# EAGLE design Eleven (EAGLE 6.2)
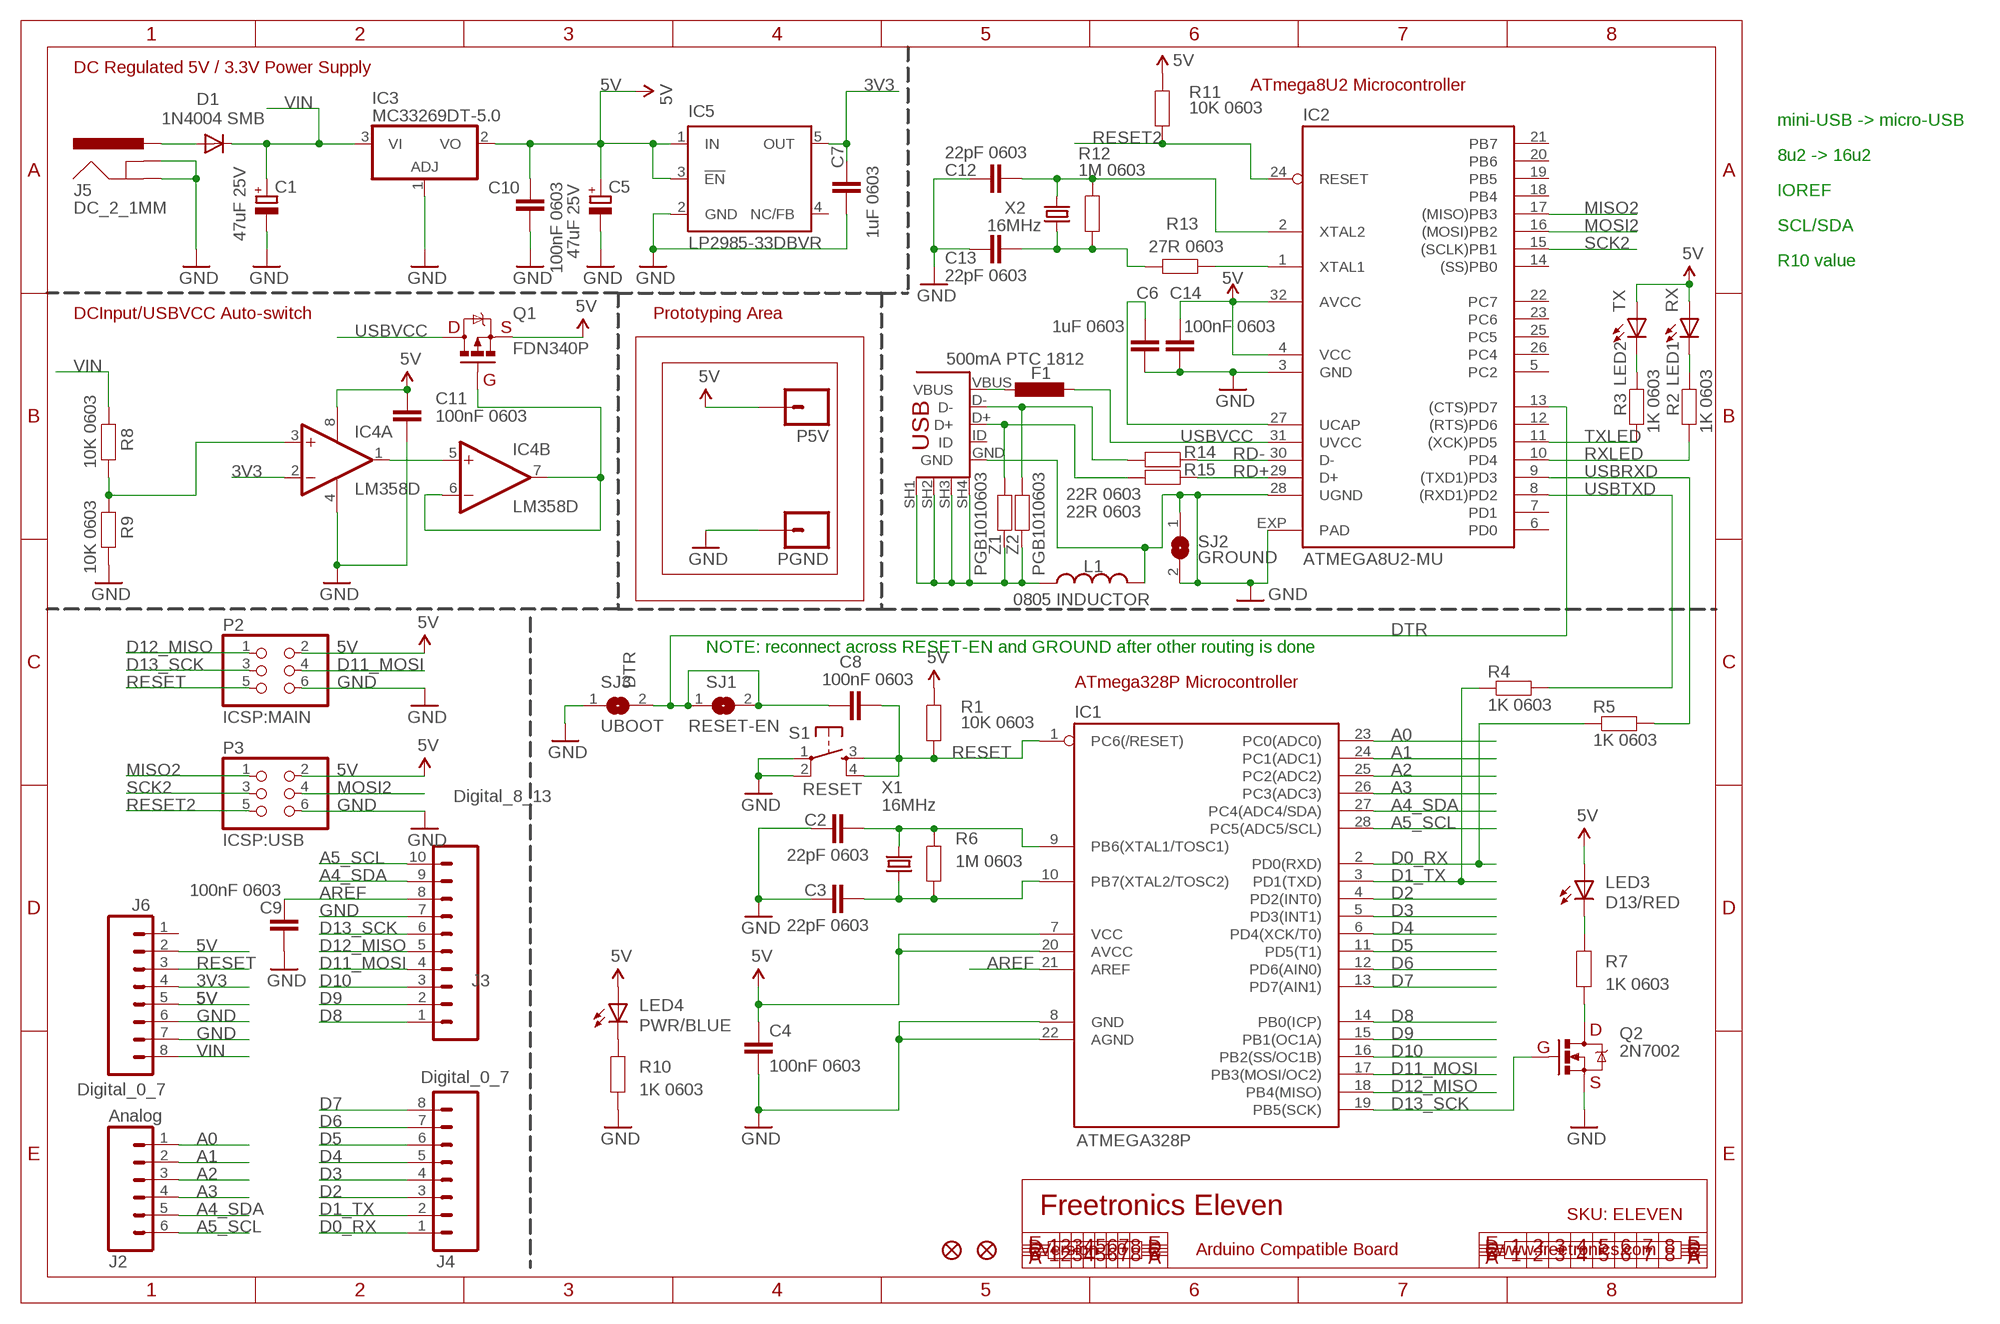
[diagram p0: schematic, sheet 1]

## Parts
C1  47uF 25V  CPOL-EUD  [PANASONIC_D]
C2  22pF 0603  CAP0603  [0603]
C3  22pF 0603  CAP0603  [0603]
C4  100nF 0603  CAP0603  [0603]
C5  47uF 25V  CPOL-EUD  [PANASONIC_D]
C6  1uF 0603  CAP0603  [0603]
C7  1uF 0603  CAP0603  [0603]
C8  100nF 0603  CAP0603  [0603]
C9  100nF 0603  CAP0603  [0603]
C10  100nF 0603  CAP0603  [0603]
C11  100nF 0603  CAP0603  [0603]
C12  22pF 0603  CAP0603  [0603]
C13  22pF 0603  CAP0603  [0603]
C14  100nF 0603  CAP0603  [0603]
D1  1N4004 SMB  DIODESMB  [SMB-DIODE]
F1  500mA PTC 1812  L-EUL1812  [L1812]
IC1  ATMEGA328P  AVR-MEGA8-P  [DIL28-3]
IC2  ATMEGA8U2-MU  ATMEL_ATMEGA8U2-MUQFN  [ATMEL_QFN32]
IC3  MC33269DT-5.0  MC33269D-5.0  [DPACK]
IC4  LM358D  [SO08]
IC5  LP2985-33DBVR  TEXAS_TPS77033  [TEXAS_SOT23-DBV]
J2  Analog  M06SIP  [1X06]
J3  Digital_8_13  M100.1  [1X10]
J4  Digital_0_7  M08  [1X08]
J5  DC_2_1MM  POWER_JACKPTH  [POWER_JACK_PTH]
J6  Digital_0_7  M08  [1X08]
L1  0805 INDUCTOR  INDUCTOR0805-LARGE  [0805-LARGE]
LED1  RX  LED0603  [LED-0603]
LED2  TX  LED0603  [LED-0603]
LED3  D13/RED  LED0603  [LED-0603]
LED4  PWR/BLUE  LED0603  [LED-0603]
P1  USB-FT  [USB-MINIB-FT]
P2  ICSP:MAIN  PINHD-2X3  [2X03]
P3  ICSP:USB  PINHD-2X3  [2X03]
P5V  M01SMD  [LUXEON-PAD]
PGND  M01SMD  [LUXEON-PAD]
Q1  FDN340P  MOSFET-PCHANNEL  [SOT23]
Q2  2N7002  MOSFET-NCHANNELSMD  [SOT23-3]
R1  10K 0603  RESISTOR0603  [0603]
R2  1K 0603  RESISTOR0603  [0603]
R3  1K 0603  RESISTOR0603  [0603]
R4  1K 0603  RESISTOR0603  [0603]
R5  1K 0603  RESISTOR0603  [0603]
R6  1M 0603  RESISTOR0603  [0603]
R7  1K 0603  RESISTOR0603  [0603]
R8  10K 0603  RESISTOR0603  [0603]
R9  10K 0603  RESISTOR0603  [0603]
R10  1K 0603  RESISTOR0603  [0603]
R11  10K 0603  RESISTOR0603  [0603]
R12  1M 0603  RESISTOR0603  [0603]
R13  27R 0603  RESISTOR0603  [0603]
R14  22R 0603  RESISTOR0603  [0603]
R15  22R 0603  RESISTOR0603  [0603]
S1  RESET  TAC_SWITCHSMD  [TACTILE_SWITCH_SMD]
SJ1  RESET-EN  SJ  [SJ]
SJ2  GROUND  SJ  [SJ]
SJ3  UBOOT  SJ  [SJ]
U$5  FIDUCIAL1X2.5  [FIDUCIAL-1X2.5]
U$14  FIDUCIAL1X2.5  [FIDUCIAL-1X2.5]
X1  16MHz  CRYSTALHC49UV  [HC49U-V]
X2  16MHz  CRYSTALHC49UV  [HC49U-V]
Z1  PGB1010603  RESISTOR0603  [0603]
Z2  PGB1010603  RESISTOR0603  [0603]

## Nets
3V3: C7.2 IC4.2(A:-IN) IC5.5(OUT) J6.4
5V: C4.1 C5.+ C10.1 C11.1 C14.1 IC1.7(VCC) IC1.20(AVCC) IC2.4(VCC) IC2.32(AVCC) IC3.2(VO) IC4.8(P:V+) IC5.1(IN) IC5.3(!EN) J6.2 J6.5 LED1.A LED2.A LED3.A LED4.A P2.2 P3.2 P5V.P$1 Q1.2(S) R1.2 R11.2
A0: IC1.23(PC0(ADC0)) J2.1
A1: IC1.24(PC1(ADC1)) J2.2
A2: IC1.25(PC2(ADC2)) J2.3
A3: IC1.26(PC3(ADC3)) J2.4
A4_SDA: IC1.27(PC4(ADC4/SDA)) J2.5 J3.9
A5_SCL: IC1.28(PC5(ADC5/SCL)) J2.6 J3.10
AREF: C9.1 IC1.21(AREF) J3.8
D0_RX: IC1.2(PD0(RXD)) J4.1 R5.1
D1_TX: IC1.3(PD1(TXD)) J4.2 R4.1
D2: IC1.4(PD2(INT0)) J4.3
D3: IC1.5(PD3(INT1)) J4.4
D4: IC1.6(PD4(XCK/T0)) J4.5
D5: IC1.11(PD5(T1)) J4.6
D6: IC1.12(PD6(AIN0)) J4.7
D7: IC1.13(PD7(AIN1)) J4.8
D8: IC1.14(PB0(ICP)) J3.1
D9: IC1.15(PB1(OC1A)) J3.2
D10: IC1.16(PB2(SS/OC1B)) J3.3
D11_MOSI: IC1.17(PB3(MOSI/OC2)) J3.4 P2.4
D12_MISO: IC1.18(PB4(MISO)) J3.5 P2.1
D13_SCK: IC1.19(PB5(SCK)) J3.6 P2.3 Q2.1(G)
DTR: C8.1 IC2.13((CTS)PD7) SJ1.1 SJ1.2 SJ3.2
GND: C1.- C2.1 C3.1 C4.2 C5.- C6.2 C7.1 C9.2 C10.2 C11.2 C12.1 C13.1 C14.2 IC1.8(GND) IC1.22(AGND) IC2.3(GND) IC2.28(UGND) IC2.EXP(PAD) IC3.1(ADJ) IC4.4(P:V-) IC5.2(GND) J3.7 J5.GND J5.GNDBREAK J6.6 J6.7 L1.2 P1.GND P2.6 P3.6 PGND.P$1 Q2.2(S) R9.1 R10.1 S1.1 S1.2 SJ2.1 SJ2.2 SJ3.1
MISO2: IC2.17((MISO)PB3) P3.1
MOSI2: IC2.16((MOSI)PB2) P3.4
N$2: IC2.1(XTAL1) R13.1
N$3: L1.1 P1.SH1(SH$1) P1.SH2(SH$2) P1.SH3(SH$3) P1.SH4(SH$4) Z1.2 Z2.2
N$4: LED3.C R7.2
N$5: C2.2 IC1.9(PB6(XTAL1/TOSC1)) R6.2 X1.2
N$6: Q2.3(D) R7.1
N$7: C3.2 IC1.10(PB7(XTAL2/TOSC2)) R6.1 X1.1
N$8: D1.A J5.PWR
N$9: IC4.3(A:+IN) R8.1 R9.2
N$10: IC4.1(A:OUT) IC4.5(B:+IN)
N$11: LED1.C R2.2
N$12: IC4.6(B:-IN) IC4.7(B:OUT) Q1.1(G)
N$13: LED2.C R3.2
N$14: LED4.C R10.2
N$16: P1.D+ R15.2 Z1.1
N$17: P1.D- R14.2 Z2.1
N$113: C12.2 IC2.2(XTAL2) R12.2 X2.2
N$114: C13.2 R12.1 R13.2 X2.1
N$115: F1.1 P1.VBUS
N$117: C6.1 IC2.27(UCAP)
RD+: IC2.29(D+) R15.1
RD-: IC2.30(D-) R14.1
RESET: C8.2 IC1.1(PC6(/RESET)) J6.3 P2.5 R1.1 S1.3 S1.4
RESET2: IC2.24(RESET) P3.5 R11.1
RXLED: IC2.10(PD4) R2.1
SCK2: IC2.15((SCLK)PB1) P3.3
TXLED: IC2.11((XCK)PD5) R3.1
USBRXD: IC2.9((TXD1)PD3) R5.2
USBTXD: IC2.8((RXD1)PD2) R4.2
USBVCC: F1.2 IC2.31(UVCC) Q1.3(D)
VIN: C1.+ D1.C IC3.3(VI) J6.8 R8.2
Unconnected: IC2.5(PC2) IC2.6(PD0) IC2.7(PD1) IC2.12((RTS)PD6) IC2.14((SS)PB0) IC2.18(PB4) IC2.19(PB5) IC2.20(PB6) IC2.21(PB7) IC2.22(PC7) IC2.23(PC6) IC2.25(PC5) IC2.26(PC4) IC5.4(NC/FB) J6.1 P1.ID

## Notes on the sheet
- DC Regulated 5V / 3.3V Power Supply
- ATmega8U2 Microcontroller
- mini-USB -> micro-USB
- 8u2 -> 16u2
- IOREF
- SCL/SDA
- R10 value
- DCInput/USBVCC Auto-switch | Prototyping Area
- D | S
- G
- NOTE: reconnect across RESET-EN and GROUND after other routing is done
- ATmega328P Microcontroller
- D
- G
- S
- Freetronics Eleven
- SKU: ELEVEN
- Version 1.0 | Arduino Compatible Board | www.freetronics.com

## Library data of the parts
C1 C5 = rcl:CPOL-EU: POLARIZED CAPACITOR, European symbol
C2-C4 C6-C14 = freetronics:CAP: Capacitor Standard 0603 ceramic capacitor, and 0.1" leaded capacitor.
D1 = freetronics:DIODE: Diode These are standard reverse protection diodes and small signal diodes. SMA package can handle up to about 1A. SOD-323 can handle about 200mA. What the SOD-323 package when ordering, there are some mfgs out there that are 5-pin packages.
F1 = rcl:L-EU: INDUCTOR, European symbol
IC1 = freetronics:AVR-MEGA8-P: MICROCONTROLLER 8 Kbytes FLASH 1 kbytes SRAM 512 bytes EEPROM USART 4-channel 10 bit ADC 2-channel 8 bit ADC
IC2 = freetronics-jon:ATMEL_ATMEGA8U2-MU
IC3 = linear:MC33269?*: Adjustable Output Low Dropout Voltage Regulator 800 mA Source: http://www.onsemi.com/pub/Collateral/MC33269-D.PDF
IC4 = linear:LM358: OP AMP also LM158; LM258; LM2904 Source: http://cache.national.com/ds/LM/LM158.pdf
IC5 = freetronics-jon:TEXAS_TPS770*: ULTRALOW-POWER 50-mA LOW-DROPOUT LINEAR REGULATORS 50-mA Low-Dropout Regulator Source: http://focus.ti.com/lit/ds/symlink/tps77001.pdf
J2 = freetronics:M06: Header 6 Standard 6-pin 0.1" header. Use with straight break away headers (SKU : PRT-00116), right angle break away headers (PRT-00553), swiss pins (PRT-00743), machine pins (PRT-00117), and female headers (PRT-00115). Molex polarized connector foot print use with SKU : PRT-08094 with associated crimp pins and housings. NOTES ON THE VARIANTS LOCK and LOCK_LONGPADS... This footprint was designed to help hold the alignment of a through-hole component (i.e. 6-pin header) while soldering it into place. You may notice that each hole has been shifted either up or down by 0.005 of an inch from it's more standard position (which is a perfectly straight line). This slight alteration caused the pins (the squares in the middle) to touch the edges of the holes. Because they are alternating, it causes a "brace" to hold the component in place. 0.005 has proven to be the perfect amount of "off-center" position when using our standard breakaway headers. Although looks a little odd when you look at the bare footprint, once you have a header in there, the alteration is very hard to notice. Also, if you push a header all the way into place, it is covered up entirely on the bottom side. This idea of altering the position of holes to aid alignment will be further integrated into the Sparkfun Library for other footprints. It can help hold any component with 3 or more connection pins.
J3 = freetronics-original:M10: Header 10 Standard 10-pin 0.1" header. Use with straight break away headers (SKU : PRT-00116), right angle break away headers (PRT-00553), swiss pins (PRT-00743), machine pins (PRT-00117), and female headers (PRT-00115).
J4 J6 = freetronics:M08: Header 8 Standard 8-pin 0.1" header. Use with straight break away headers (SKU : PRT-00116), right angle break away headers (PRT-00553), swiss pins (PRT-00743), machine pins (PRT-00117), and female headers (PRT-00115).
J5 = freetronics:POWER_JACK: Power Jack This is the standard 5.5mm barrel jack for power. The PTH is the most common, proven, reliable, footprint. All others are experimental. The Slot footprint only works if the mill layer is transmitted to the PCB fab house so be warned. Spark Fun Electronics SKU : PRT-00119. Mating wall wart : TOL-00298 (and others)
L1 = freetronics-master-v1:INDUCTOR: Inductors Basic Inductor/Choke - 0603 and 1206. Footprints are not proven and vary greatly between part numbers.
LED1-LED4 = freetronics:LED: LEDs Standard schematic elements and footprints for 5mm, 3mm, 1206, and 0603 sized LEDs. 5mm - Spark Fun Electronics SKU : COM-00529 (and others)
P1 = freetronics-master-v1:USB-FT
P2 P3 = pinhead:PINHD-2X3: PIN HEADER
P5V PGND = freetronics:M01: Header 1 Standard 1-pin 0.1" header. Use with straight break away headers (SKU : PRT-00116), right angle break away headers (PRT-00553), swiss pins (PRT-00743), machine pins (PRT-00117), and female headers (PRT-00115).
Q1 = freetronics-master-v1:MOSFET-PCHANNEL
Q2 = freetronics:MOSFET-NCHANNEL
R1-R15 Z1 Z2 = freetronics:RESISTOR: Resistor Basic schematic elements and footprints for 0603, 1206, and PTH 1/10th watt (small) resistors.
S1 = freetronics:TAC_SWITCH: Momentary Switch Button commonly used for reset or general input. Spark Fun Electronics SKU : COM-00097
SJ1-SJ3 = jumper:SJ: SMD solder JUMPER
U$5 U$14 = freetronics:FIDUCIAL: Fiducial Alignment Points Various fiducial points for machine vision alignment.
X1 X2 = freetronics-master-v1:CRYSTAL: Crystals Various standard crystals. Proven footprints. Spark Fun Electronics SKU : COM-00534

## Board
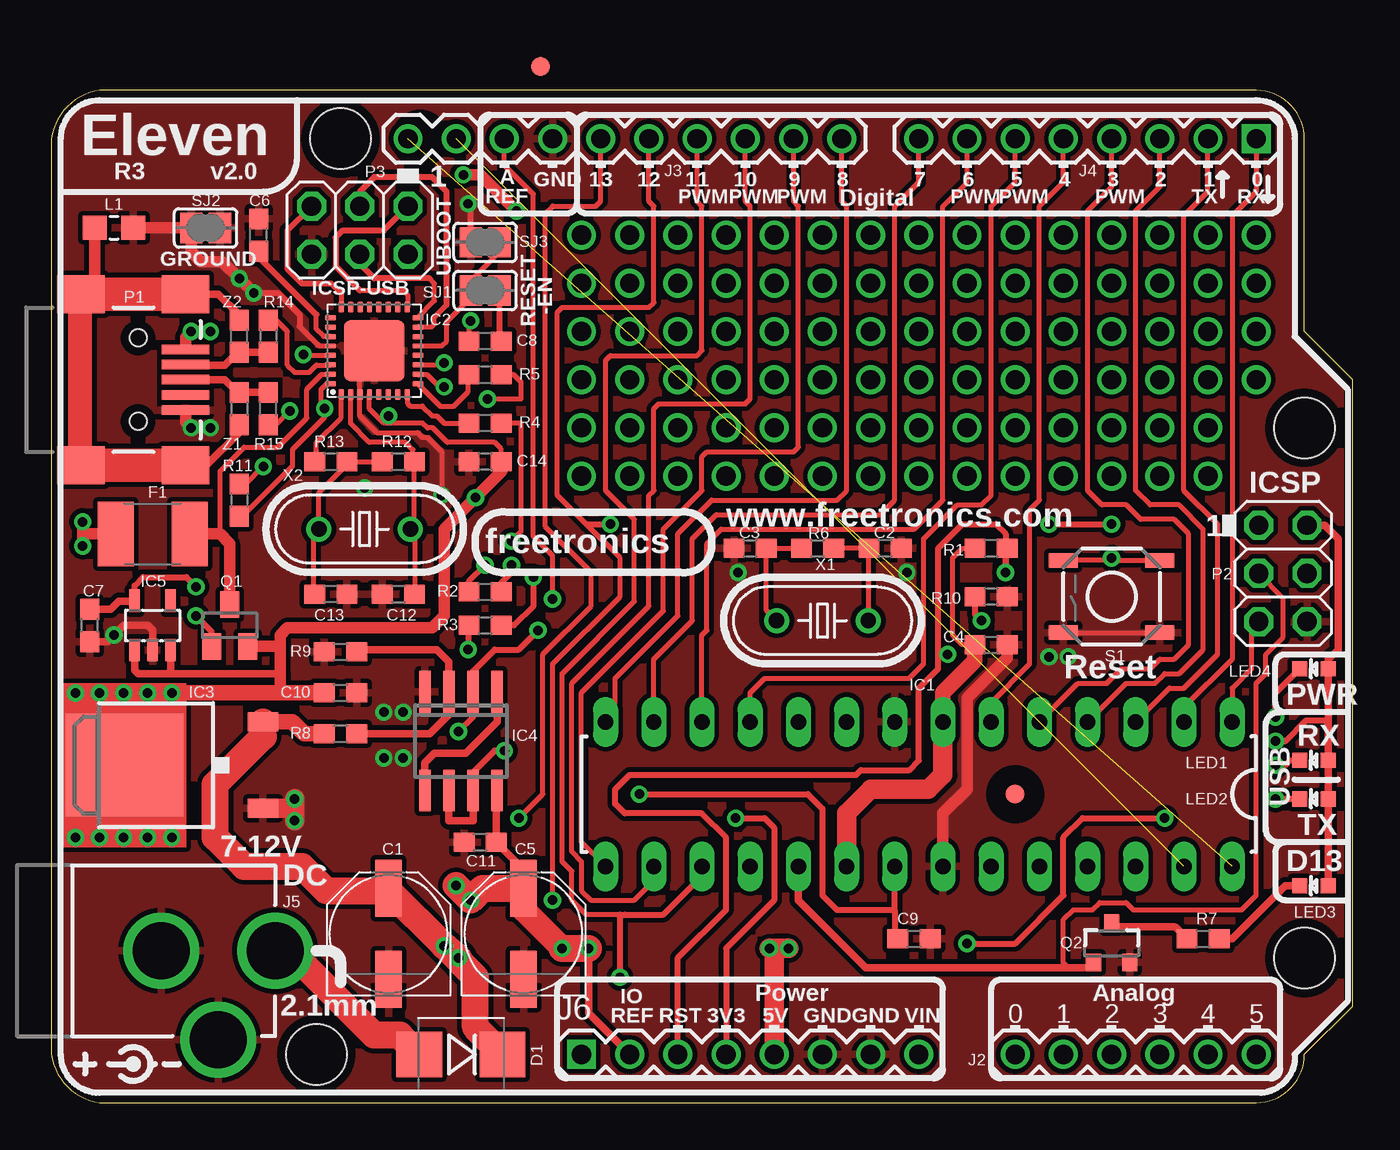
[diagram p1: board, top side]
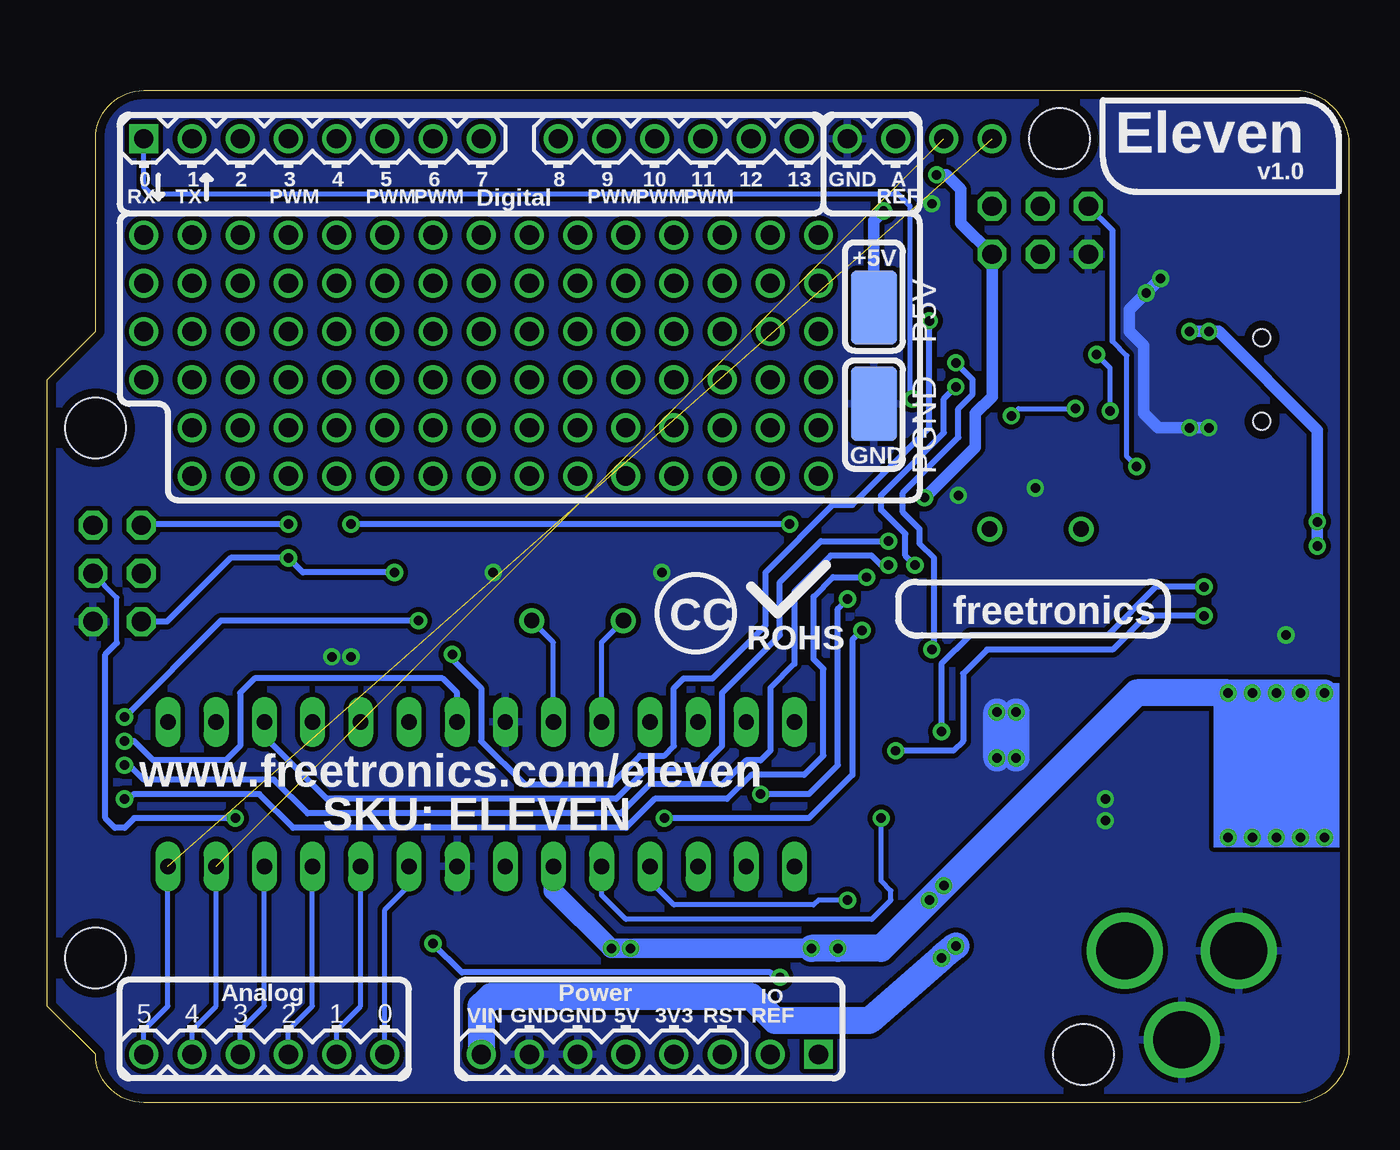
[diagram p2: board, bottom side, seen from below]

Size 68.58 x 53.34 mm. Coordinates in mm from the lower left corner, seen from the top.
Outline: 0,2.54 arc74 2.54,0 63.5,0 arc90 66.04,2.54 68.58,5.08 68.58,38.1 66.04,40.64 66.04,50.8 arc90 63.5,53.34 2.54,53.34 arc74 0,50.8 0,2.54
Copper layers (1*16): Top 0.035mm / dielectric 1.5mm / Bottom 0.035mm
Design rules: minimum track width 10mil, minimum drill 18mil, track to track 10mil, track to pad 10mil, pad to pad 10mil, via to via 10mil, smd to smd 8mil, copper to edge 18mil, drill to drill 8mil, minimum pad ring 10mil, minimum via ring 8mil, stop-mask expansion 4mil, vias tented up to drill 25mil, thermal gap 10mil
Holes 3.2 mm at 66.04,35.56 66.04,7.62 15.24,50.8 13.97,2.54
tRestrict: area 18.4,49.8 to 20.4,51.8; area 49.8,15.2 to 51.8,17.3

### Footprints (pad centres in the part's own frame; a part is rotated, then mirrored left to right if it is on the bottom)
PANASONIC_D = smd 3 x 1.4: + 2.4,0; - -2.4,0
0603 = smd 1.1 x 1: 1 -0.85,0; 2 0.85,0
SMB-DIODE = smd 2.4 x 2.4: A 2.2,0; C -2.2,0
L1812 = smd 1.9 x 3.4: 1 -1.95,0; 2 1.95,0
DIL28-3 = drill 0.813 long: 1 -16.51,-3.81; 2 -13.97,-3.81; 3 -11.43,-3.81; 4 -8.89,-3.81; 5 -6.35,-3.81; 6 -3.81,-3.81; 7 -1.27,-3.81; 8 1.27,-3.81; 9 3.81,-3.81; 10 6.35,-3.81; 11 8.89,-3.81; 12 11.43,-3.81; 13 13.97,-3.81; 14 16.51,-3.81; 15 16.51,3.81; 16 13.97,3.81; 17 11.43,3.81; 18 8.89,3.81; 19 6.35,3.81; 20 3.81,3.81; 21 1.27,3.81; 22 -1.27,3.81; 23 -3.81,3.81; 24 -6.35,3.81; 25 -8.89,3.81; 26 -11.43,3.81; 27 -13.97,3.81; 28 -16.51,3.81
ATMEL_QFN32 = smd 0.6 x 0.3: 1 -2.3,1.75; 2 -2.3,1.25; 3 -2.3,0.75; 4 -2.3,0.25; 5 -2.3,-0.25; 6 -2.3,-0.75; 7 -2.3,-1.25; 8 -2.3,-1.75; 17 2.3,-1.75; 18 2.3,-1.25; 19 2.3,-0.75; 20 2.3,-0.25; 21 2.3,0.25; 22 2.3,0.75; 23 2.3,1.25; 24 2.3,1.75 | smd 0.3 x 0.6: 9 -1.75,-2.3; 10 -1.25,-2.3; 11 -0.75,-2.3; 12 -0.25,-2.3; 13 0.25,-2.3; 14 0.75,-2.3; 15 1.25,-2.3; 16 1.75,-2.3; 25 1.75,2.3; 26 1.25,2.3; 27 0.75,2.3; 28 0.25,2.3; 29 -0.25,2.3; 30 -0.75,2.3; 31 -1.25,2.3; 32 -1.75,2.3 | smd 3.2 x 3.2: EXP 0,0
DPACK = smd 1 x 1.6: 1 -2.28,-4.8; 3 2.28,-4.8 | smd 5.4 x 6.2: 2 0,2.5
SO08 = smd 0.6 x 2.2: 1 -1.905,-2.6; 2 -0.635,-2.6; 3 0.635,-2.6; 4 1.905,-2.6; 5 1.905,2.6; 6 0.635,2.6; 7 -0.635,2.6; 8 -1.905,2.6
TEXAS_SOT23-DBV = smd 0.55 x 1.2: 1 -0.95,-1.3; 2 0,-1.3; 3 0.95,-1.3; 4 0.95,1.3; 5 -0.95,1.3
1X06 = drill 1.016: 1 0,0; 2 2.54,0; 3 5.08,0; 4 7.62,0; 5 10.16,0; 6 12.7,0
1X10 = drill 1.016: 1 0,0; 2 2.54,0; 3 5.08,0; 4 7.62,0; 5 10.16,0; 6 12.7,0; 7 15.24,0; 8 17.78,0; 9 20.32,0; 10 22.86,0
1X08 = drill 1.016 square: 1 0,0 | drill 1.016: 2 2.54,0; 3 5.08,0; 4 7.62,0; 5 10.16,0; 6 12.7,0; 7 15.24,0; 8 17.78,0
POWER_JACK_PTH = drill 2.997: GND 0,7.7; GNDBREAK 4.7,10.7; PWR 0,13.7
0805-LARGE = smd 1.27 x 1.27: 1 -1.016,0; 2 1.016,0
LED-0603 = smd 0.8 x 0.8: A 0,-0.75; C 0,0.75
USB-MINIB-FT = smd 2.5 x 0.5: D+ 2.5,0; D- 2.5,0.8; GND 2.5,-1.6; ID 2.5,-0.8; VBUS 2.5,1.6 | smd 2.5 x 2: SH1 -3,-4.5; SH2 -3,4.5; SH3 2.5,4.5; SH4 2.5,-4.5 | hole 0.9: 0,2.2; 0,-2.2
2X03 = drill 1.016 octagon: 1 -2.54,-1.27; 2 -2.54,1.27; 3 0,-1.27; 4 0,1.27; 5 2.54,-1.27; 6 2.54,1.27
LUXEON-PAD = smd 3.9 x 2.4: P$1 0,0
SOT23 = smd 1 x 1.4: 1 -0.95,-1.1; 2 0.95,-1.1; 3 0,1.1
SOT23-3 = smd 0.8 x 0.9: 1 -0.95,-1; 2 0.95,-1; 3 0,1.1
TACTILE_SWITCH_SMD = smd 1.524 x 0.762: 1 -2.54,1.905; 2 2.54,1.905; 3 -2.54,-1.905; 4 2.54,-1.905
SJ = smd 1.168 x 1.6: 1 -0.762,0; 2 0.762,0
FIDUCIAL-1X2.5 = smd 1 x 1: 1 0,0
HC49U-V = drill 0.813: 1 -2.413,0; 2 2.413,0

### Placement (x,y rotation side)
C1  17.78,8.89 90 top
C2  43.94,29.21 180 top
C3  36.83,29.21 0 top
C4  49.53,24.13 0 top
C5  24.89,8.89 90 top
C6  10.92,45.72 90 top
C7  2.03,25.15 90 top
C8  22.86,40.13 180 top
C9  45.47,8.64 0 top
C10  15.24,21.59 0 top
C11  22.61,13.72 180 top
C12  18.29,26.8 0 top
C13  14.73,26.8 180 top
C14  22.86,33.78 180 top
D1  21.59,2.54 180 top
F1  5.33,29.97 0 top
IC1  45.72,16.26 180 top
IC2  17.02,39.62 90 top
IC3  6.35,17.78 90 top
IC4  21.59,19.05 180 top
IC5  5.33,25.15 0 top
J2  50.8,2.54 0 top
J3  41.66,50.8 180 top
J4  63.5,50.8 180 top
J5  -1.91,8 270 top
J6  27.94,2.54 0 top
L1  3.3,46.1 0 top
LED1  66.55,18.03 90 top
LED2  66.55,16 90 top
LED3  66.55,11.43 90 top
LED4  66.55,22.86 90 top
P1  4.57,38.1 0 top
P2  64.91,27.89 270 top
P3  16.26,45.97 180 top
P5V  25.02,41.91 270 bottom
PGND  25.02,36.83 270 bottom
Q1  9.4,25.15 0 top
Q2  55.88,8.38 0 top
R1  49.53,29.21 180 top
R2  22.86,26.92 0 top
R3  22.86,25.15 0 top
R4  22.86,35.81 180 top
R5  22.86,38.35 180 top
R6  40.39,29.21 0 top
R7  60.71,8.64 0 top
R8  15.24,19.43 180 top
R9  15.24,23.75 0 top
R10  49.53,26.67 180 top
R11  9.91,31.75 270 top
R12  18.29,33.78 0 top
R13  14.73,33.78 0 top
R14  11.43,40.39 270 top
R15  11.43,36.58 90 top
S1  55.88,26.67 180 top
SJ1  22.86,42.8 0 top
SJ2  8.13,46.1 0 top
SJ3  22.86,45.34 0 top
U$5  25.78,54.61 0 top
U$14  50.8,16.26 0 top
X1  40.64,25.4 0 top
X2  16.51,30.23 0 top
Z1  9.91,36.58 270 top
Z2  9.91,40.39 90 top

### Tracks (layer width: path | path; a pad name or v marks a point on that pad's centre or on a via)
3V3  (via drill 0.5)
  Top 0.305: J6.4 35.56,8.13 38.1,10.67 38.1,14.48 37.59,14.99 v36.07,14.99 | v25.65,24.89 24.64,23.88 23.37,23.88 22.23,22.73 IC4.2 22.23,20.32 v21.46,19.56 | IC5.5 4.38,27.24 4.83,27.69 7.11,27.69 v7.62,27.18
  Top 0.406: C7.2 3.14,26 3.56,26.42 4.35,26.42 IC5.5
  Bottom 0.305: v36.07,14.99 28.45,14.99 26.16,17.27 26.16,24.38 v25.65,24.89 | v7.62,27.18 10.16,27.18 12.7,24.64 19.94,24.64 21.46,23.11 v21.46,19.56
5V  (via drill 0.5)
  Top 0.254: R1.2 48.01,29.21 47.5,28.7 47.5,24.64 48.01,24.13 C4.1 | 17.78,35.81 19.56,35.81 19.81,35.56 20.11,35.56 20.87,34.8 23.37,34.8 23.71,34.46 C14.1 23.75,33.78 | 17.78,35.81 17.53,35.81 16.77,36.57 IC2.4 | IC2.32 14.51,37.87 14.22,37.59 14.22,36.75 v14.4,36.58 14.4,36.12 12.7,34.42 12.7,33.53 10.07,30.9 R11.2 | 17.78,35.81 v17.78,36.2 | 12.06,24.13 11.98,24.05
  Top 0.305: 67.3,20.15 66.12,20.15 65.02,19.05 v64.52,19.05
  Top 0.406: IC4.8 23.46,16.41 C11.1 24.64,12.53 | 24.89,10.16 24.64,12.53 | LED3.A LED2.A LED1.A 67.3,20.15 LED4.A 67.3,23.36 67.82,23.88 67.82,29.72 67.11,30.43 P2.2 | IC5.1 4.38,22.79 4.57,22.61 6.22,22.61 | 12.06,22.61 6.22,22.61 | IC5.3 6.28,22.67 6.22,22.61 | 24.64,12.53 24.89,12.28 C5.+ | J6.2 28.32,4.7 v28.32,8.13
  Top 0.61: 23.75,33.78 23.75,33.27 v22.35,31.88 20.7,30.23 20.7,25.65 20.07,25.02 12.45,25.02 12.06,24.64 12.06,24.13 12.06,22.61 12.06,21.59 | 11.98,24.05 Q1.2 | v24.51,46.99 22.61,48.9 v21.72,48.9
  Top 0.813: v5.08,21.59 v6.35,21.59 12.06,21.59 C10.1 | IC1.7 46.99,21.59 48.68,23.28 C4.1
  Top 1.016: IC3.2 3.85,18.07 5.08,19.3 v5.08,21.59 | 38.1,8.13 J6.5 | v37.85,8.13 38.1,8.13 | v38.86,8.13 38.1,8.13 | IC1.20 41.91,15.24 43.18,16.51 46.23,16.51 46.99,17.27 IC1.7
  Top 1.27: v26.92,8.13 24.89,10.16
  Top 1.422: v26.92,8.13 28.31,8.13 | v21.34,11.43 v22.1,10.67 22.72,11.29 C5.+
  Bottom 0.254: v14.4,36.58 17.4,36.58 v17.78,36.2
  Bottom 0.305: v64.52,19.05 64.01,19.05 62.99,18.03 59.18,18.03 58.42,18.8 58.42,21.59 57.66,22.35 47.75,22.35 46.99,21.59 IC1.7
  Bottom 0.61: v21.72,48.9 21.21,48.9 20.45,48.13 20.45,46.35 P3.2 18.8,37.21 19.68,36.32 19.68,34.54 v22.35,31.88 | P5V.P$1 25.02,46.48 v24.51,46.99
  Bottom 1.016: IC1.20 41.91,11.18 v38.86,8.13 v37.85,8.13 v28.32,8.13
  Bottom 1.422: v28.32,8.13 v26.92,8.13 24.64,8.13 11.18,21.59 v6.35,21.59 1.27,21.59
A0
  Bottom 0.254: J2.1 50.8,10.16 49.53,11.43 IC1.23
A1
  Bottom 0.254: J2.2 53.34,3.81 52.07,5.08 IC1.24
A2
  Bottom 0.254: J2.3 55.88,3.81 54.61,5.08 IC1.25
A3
  Bottom 0.254: J2.4 58.42,3.81 57.15,5.08 IC1.26
A4_SDA  (1 unrouted)
  Bottom 0.254: J2.5 60.96,3.81 59.69,5.08 IC1.27
A5_SCL  (1 unrouted)
  Bottom 0.254: J2.6 63.5,3.81 62.23,5.08 IC1.28
AREF  (via drill 0.5)
  Top 0.254: J3.8 23.88,49.4 25.4,47.88 25.4,29.84 26.42,28.83 v26.42,26.54
  Top 0.305: 44.45,10.16 44.45,8.64 | 44.45,10.16 IC1.21 | 44.45,10.16 41.4,10.16 40.64,10.92 40.64,15.49 39.88,16.26 v30.99,16.26
  Top 0.406: 44.45,8.64 C9.1
  Bottom 0.305: v30.99,16.26 28.45,16.26 26.92,17.78 26.92,26.04 v26.42,26.54
D0_RX  (via drill 0.5)
  Top 0.254: IC1.2 59.69,20.83 62.23,23.37 62.23,46.74 63.5,48.01 J4.1 | R5.1 24.38,38.35 24.77,37.97 24.77,37.08 v22.99,37.08
  Bottom 0.254: v22.99,37.08 23.11,37.34 23.11,47.24 23.75,47.88 63.12,47.88 63.5,48.26 J4.1
D1_TX  (via drill 0.5)
  Top 0.254: IC1.3 58.93,21.84 59.69,21.84 61.47,23.62 61.47,30.48 59.69,32.26 59.69,46.74 60.96,48.01 J4.2 | v24.26,29.59 24.77,30.1 24.77,35.81 R4.1
  Bottom 0.305: v24.26,29.59 27.81,29.59 29.97,27.43 29.97,24.64 33.02,21.59 33.02,18.8 34.29,17.53 37.08,17.53 38.61,16 53.85,16 57.15,19.3 IC1.3
D2
  Top 0.254: IC1.4 56.64,22.1 58.17,22.1 58.67,22.61 59.44,22.61 60.71,23.88 60.71,30.23 59.44,31.5 57.91,31.5 57.15,32.26 57.15,46.99 58.42,48.26 J4.3
D3
  Top 0.254: IC1.5 54.1,22.1 55.63,22.1 56.39,22.86 57.91,22.86 58.42,23.37 59.18,23.37 59.94,24.13 59.94,29.97 59.18,30.73 57.4,30.73 56.64,31.5 55.37,31.5 54.61,32.26 54.61,46.99 55.88,48.26 J4.4
D4
  Top 0.254: IC1.6 49.53,21.08 51.56,23.11 51.56,31.24 52.07,31.75 52.07,47.24 53.34,48.51 J4.5
D5
  Top 0.254: J4.6 50.8,48.51 49.53,47.24 49.53,32 49.02,31.5 47.75,31.5 45.97,29.72 45.97,23.11 45.21,22.35 37.59,22.35 36.83,21.59 IC1.11
D6
  Top 0.254: J4.7 48.26,48.51 46.99,47.24 46.99,31.75 45.47,30.23 35.31,30.23 34.54,29.46 34.54,24.89 34.29,24.64 IC1.12
D7
  Top 0.254: J4.8 45.72,48.51 44.45,47.24 44.45,31.75 43.69,30.99 35.05,30.99 33.78,29.72 33.78,25.4 31.75,23.37 IC1.13
D8
  Top 0.254: J3.1 41.66,47.5 41.91,47.24 41.91,32.26 41.4,31.75 34.8,31.75 33.02,29.97 33.02,25.65 29.72,22.35 29.72,21.08 29.21,20.57 IC1.14
D9
  Top 0.254: J3.2 39.12,47.5 39.37,47.24 39.37,34.54 39.12,34.29 34.54,34.29 34.29,34.04 34.29,32.26 32.26,30.23 32.26,25.91 27.94,21.59 27.94,13.72 IC1.15
D10
  Top 0.254: J3.3 36.58,47.5 36.83,47.24 36.83,37.08 36.58,36.83 32,36.83 31.75,36.58 31.75,32.26 31.5,32 31.5,26.16 27.43,22.1 27.43,13.21 27.94,12.7 27.94,11.18 28.45,10.67 30.73,10.67 31.75,11.68 IC1.16
D11_MOSI  (via drill 0.5)
  Top 0.254: J3.4 34.04,47.5 34.29,47.24 34.29,39.62 34.04,39.37 29.46,39.37 29.21,39.12 29.21,32.26 30.73,30.73 30.73,26.42 26.92,22.61 26.92,12.7 27.43,12.19 27.43,10.67 28.19,9.91 29.97,9.91
  Top 0.305: IC1.17 34.29,11.94 32.26,9.91 30.23,9.91 29.97,9.91 v29.97,6.6 | v58.67,14.99 54.36,14.99 53.34,13.97 53.34,10.92 50.8,8.38 v48.26,8.38
  Bottom 0.254: P2.4 64.92,26.61 64.92,24.23
  Bottom 0.305: 64.92,24.23 65.53,23.62 65.53,14.99 65.02,14.48 64.52,14.48 64.01,14.99 v58.67,14.99 | v48.26,8.38 46.74,6.86 30.48,6.86 30.23,6.6 v29.97,6.6
D12_MISO  (via drill 0.5)
  Top 0.254: J3.5 31.5,47.5 31.75,47.24 31.75,42.16 31.5,41.91 26.92,41.91 26.67,41.66 26.67,32 28.19,30.48 29.97,28.7 29.97,26.67 26.42,23.11 v26.42,10.67
  Top 0.305: v52.58,30.48 v55.88,30.48 | 28.19,30.48 v29.46,30.48
  Bottom 0.254: v26.42,10.67 27.94,10.67 28.19,10.41 35.56,10.41 36.83,11.68 IC1.18
  Bottom 0.305: P2.1 63.59,30.48 v55.88,30.48 | v29.46,30.48 v52.58,30.48
D13_SCK  (via drill 0.5)
  Top 0.254: J3.6 28.96,47.5 28.7,47.24 26.42,47.24 26.04,46.86 26.04,30.35 28.45,27.94 28.45,26.16 25.91,23.62 25.91,16.26 v24.64,14.99 | P2.3 64.92,26.57 64.92,24.54 64.01,23.62 64.01,22.61 63.5,22.1 63.5,10.92 62.74,10.16 57.02,10.16 56.64,10.54 55.24,10.54 54.86,10.16 53.85,10.16 53.34,9.65 53.34,7.37 53.59,7.11
  Top 0.406: IC1.19 39.37,10.67 42.93,7.11 53.59,7.11 54.66,7.11 Q2.1
  Bottom 0.254: v24.64,14.99 24.64,11.68 24.13,11.18 24.13,10.67 25.15,9.65 38.1,9.65 39.37,10.92 IC1.19
DTR
  Top 0.254: IC2.13 20.57,39.88 20.83,40.13 20.83,41.15 22.1,42.42 SJ1.1 22.1,43.31 23.37,44.58 23.37,45.09 SJ3.2
  Top 0.305: C8.1 23.62,40.73 SJ1.2
  Top 0.61: SJ1.1 SJ1.2
GND  (via drill 0.5)
  Top 0.254: S1.2 S1.1 | 16.26,37.34 IC2.3 | 16.26,37.34 16.26,39.62 IC2.EXP | 16.26,37.34 16.26,36.2 17.14,35.31 19.3,35.31 19.56,35.05 19.81,35.05 20.57,34.29 v20.57,32 | IC2.28 14.1,39.87 13.08,40.89
  Top 0.305: SJ3.1 22.1,47.24 v21.97,47.37 | 13.08,40.89 13.08,41.53 11.94,42.67 v10.67,42.67
  Top 0.406: IC5.2 5.33,24.89 5.08,25.15 3.81,25.15 v3.3,24.64 2.96,24.3 C7.1
  Top 0.61: C4.2 50.38,23.46 48.26,21.34 48.26,16.51 46.99,15.24 IC1.22 | v8.38,35.56 v7.37,35.56 7.07,35.85 7.07,36.41 | v10.67,42.67 v9.91,43.43 9.02,44.32 7.87,44.32 7.37,44.83 SJ2.1 | SJ2.1 L1.2 | SJ2.1 SJ2.2
  Top 1.016: 12.83,15.5 v12.83,16 | 12.83,15.5 v12.83,14.86 | IC3.1 12.83,15.5
  Bottom 0.61: v7.37,35.56 10.03,35.56 10.79,36.32 10.79,39.88 11.56,40.64 11.56,41.78 v10.67,42.67 v9.91,43.43
  Bottom 1.422: v18.54,18.16 v18.54,20.57 | v17.53,18.16 v17.53,20.57
  other vias: 36.2,27.94 16.51,32.38 52.58,23.5 53.59,23.5 45.09,27.94
  pour Bottom: 0,50.8 arc-74 2.54,53.34 63.5,53.34 arc-74 66.04,50.8 66.04,40.64 68.58,38.1 68.58,5.08 66.04,2.54 arc-74 63.5,0 2.54,0 arc-74 0,2.54
  pour Top: 0,50.8 arc-74 2.54,53.34 63.5,53.34 arc-74 66.04,50.8 66.04,40.64 68.58,38.1 68.58,5.08 66.04,2.54 arc-74 63.5,0 2.54,0 arc-74 0,2.54
MISO2
  Top 0.254: IC2.17 18.8,41.95 18.8,42.55 18.54,42.8 16.26,42.8
  Top 0.305: 16.26,42.8 14.99,44.07 14.99,45.59 15.37,45.97 17.53,45.97 P3.1
MOSI2
  Top 0.254: IC2.16 20.19,42.25 20.19,43.18 19.94,43.43
  Top 0.305: 19.94,43.43 17.02,43.43 16.26,44.2 P3.4
N$2
  Top 0.254: R13.1 13.97,34.38 13.97,34.8 15.27,36.1 IC2.1
N$3
  Top 0.406: P1.SH3 8.8,42.6 9.91,41.53 Z2.2 | P1.SH4 8.16,33.6 9.91,35.31 Z1.2 | 1.52,42.55 P1.SH2 | 1.52,33.66 P1.SH1
  Top 0.61: 2.29,42.6 L1.1
  Top 1.27: 1.52,33.66 1.52,42.55
  Top 1.778: P1.SH2 2.29,42.6 P1.SH3 | P1.SH1 P1.SH4
N$4
  Top 0.406: R7.2 62.23,8.64 65.02,11.43 LED3.C
N$5
  Top 0.254: R6.2 C2.2 43.09,25.44 X1.2
  Bottom 0.254: X1.2 41.91,24.26 IC1.9
N$6
  Top 0.406: R7.1 59.26,9.23 59.18,9.27 56.09,9.27 Q2.3
N$7
  Top 0.254: X1.1 37.68,25.95 C3.2 R6.1
  Bottom 0.254: X1.1 39.37,24.26 IC1.10
N$8
  Top 1.422: D1.A 18.37,3.56 17.02,3.56 12.57,8 J5.PWR
N$9
  Top 0.406: R8.1 19.94,19.43 20.95,20.45 IC4.3 20.95,23.24 20.32,23.88 16.26,23.88 16.22,23.91 16.22,23.96 R9.2
N$10
  Top 0.406: IC4.5 19.68,17.91 20.19,18.41 21.84,18.41 23.5,20.07 IC4.1
N$11  (via drill 0.5)
  Top 0.305: LED1.C 65.28,18.03 65.02,17.78 v64.52,17.78 | R2.2 23.71,27.39 24.26,27.94 v24.26,28.32
  Bottom 0.305: v64.52,17.78 64.26,17.78 63.5,17.02 56.64,17.02 54.86,15.24 38.35,15.24 36.83,16.76 33.02,16.76 31.75,18.03 30.99,18.03 30.48,18.54 30.48,21.84 29.21,23.11 29.21,26.92 27.3,28.83 25.15,28.83 24.64,28.32 v24.26,28.32
N$12  (via drill 0.5)
  Top 0.305: 22.16,16.45 22.23,16.38 22.23,17.4 23.37,18.54 v23.88,18.54 | Q1.1 8.45,24.83 v7.62,25.65
  Top 0.406: IC4.7 22.23,16.38 22.23,14.86 20.95,14.86 IC4.6
  Bottom 0.305: v7.62,25.65 10.67,25.65 12.45,23.88 19.05,23.88 20.32,22.61 20.32,19.05 20.83,18.54 v23.88,18.54
N$13  (via drill 0.5)
  Top 0.305: v64.52,16 LED2.C | v25.4,27.69 25.4,26.16 24.38,25.15 R3.2
  Bottom 0.305: v25.4,27.69 27.18,27.69 28.19,26.67 28.19,23.37 27.69,22.86 27.69,18.29 28.7,17.27 31.5,17.27 32.77,16 36.58,16 38.1,14.48 55.63,14.48 57.4,16.26 64.01,16.26 v64.52,16
N$14  (via drill 0.5)
  Top 0.305: LED4.C 64.52,21.58 v64.52,20.32 | v49.02,25.4 48.68,25.74 R10.2
  Bottom 0.305: v64.52,20.32 59.44,25.4 v49.02,25.4
N$15  (via drill 1.02)
  other vias: 33.02,40.64
N$16
  Top 0.406: P1.D+ 9.14,38.1 9.82,37.43 Z1.1 R15.2
N$17
  Top 0.406: P1.D- 7.11,38.86 9.14,38.86 9.82,39.54 Z2.1 R14.2
N$18  (via drill 1.02)
  other vias: 33.02,43.18
N$19  (via drill 1.02)
  other vias: 33.02,45.72
N$20  (via drill 1.02)
  other vias: 30.48,40.64
N$21  (via drill 1.02)
  other vias: 30.48,43.18
N$22  (via drill 1.02)
  other vias: 30.48,45.72
N$23  (via drill 1.02)
  other vias: 27.94,40.64
N$24  (via drill 1.02)
  other vias: 27.94,43.18
N$25  (via drill 1.02)
  other vias: 27.94,45.72
N$26  (via drill 1.02)
  other vias: 40.64,40.64
N$27  (via drill 1.02)
  other vias: 40.64,43.18
N$28  (via drill 1.02)
  other vias: 40.64,45.72
N$29  (via drill 1.02)
  other vias: 38.1,40.64
N$30  (via drill 1.02)
  other vias: 38.1,43.18
N$31  (via drill 1.02)
  other vias: 38.1,45.72
N$32  (via drill 1.02)
  other vias: 35.56,40.64
N$33  (via drill 1.02)
  other vias: 35.56,43.18
N$34  (via drill 1.02)
  other vias: 35.56,45.72
N$35  (via drill 1.02)
  other vias: 48.26,40.64
N$36  (via drill 1.02)
  other vias: 48.26,43.18
N$37  (via drill 1.02)
  other vias: 48.26,45.72
N$38  (via drill 1.02)
  other vias: 45.72,40.64
N$39  (via drill 1.02)
  other vias: 45.72,43.18
N$40  (via drill 1.02)
  other vias: 45.72,45.72
N$41  (via drill 1.02)
  other vias: 43.18,40.64
N$42  (via drill 1.02)
  other vias: 43.18,43.18
N$43  (via drill 1.02)
  other vias: 43.18,45.72
N$44  (via drill 1.02)
  other vias: 55.88,40.64
N$45  (via drill 1.02)
  other vias: 55.88,43.18
N$46  (via drill 1.02)
  other vias: 55.88,45.72
N$47  (via drill 1.02)
  other vias: 53.34,40.64
N$48  (via drill 1.02)
  other vias: 53.34,43.18
N$49  (via drill 1.02)
  other vias: 53.34,45.72
N$50  (via drill 1.02)
  other vias: 50.8,40.64
N$51  (via drill 1.02)
  other vias: 50.8,43.18
N$52  (via drill 1.02)
  other vias: 50.8,45.72
N$53  (via drill 1.02)
  other vias: 63.5,40.64
N$54  (via drill 1.02)
  other vias: 63.5,43.18
N$55  (via drill 1.02)
  other vias: 63.5,45.72
N$56  (via drill 1.02)
  other vias: 60.96,40.64
N$57  (via drill 1.02)
  other vias: 60.96,43.18
N$58  (via drill 1.02)
  other vias: 60.96,45.72
N$59  (via drill 1.02)
  other vias: 58.42,40.64
N$60  (via drill 1.02)
  other vias: 58.42,43.18
N$61  (via drill 1.02)
  other vias: 58.42,45.72
N$62  (via drill 1.02)
  other vias: 33.02,33.02
N$63  (via drill 1.02)
  other vias: 33.02,35.56
N$64  (via drill 1.02)
  other vias: 33.02,38.1
N$65  (via drill 1.02)
  other vias: 30.48,33.02
N$66  (via drill 1.02)
  other vias: 30.48,35.56
N$67  (via drill 1.02)
  other vias: 30.48,38.1
N$68  (via drill 1.02)
  other vias: 27.94,33.02
N$69  (via drill 1.02)
  other vias: 27.94,35.56
N$70  (via drill 1.02)
  other vias: 27.94,38.1
N$71  (via drill 1.02)
  other vias: 40.64,33.02
N$72  (via drill 1.02)
  other vias: 40.64,35.56
N$73  (via drill 1.02)
  other vias: 40.64,38.1
N$74  (via drill 1.02)
  other vias: 38.1,33.02
N$75  (via drill 1.02)
  other vias: 38.1,35.56
N$76  (via drill 1.02)
  other vias: 38.1,38.1
N$77  (via drill 1.02)
  other vias: 35.56,33.02
N$78  (via drill 1.02)
  other vias: 35.56,35.56
N$79  (via drill 1.02)
  other vias: 35.56,38.1
N$80  (via drill 1.02)
  other vias: 48.26,33.02
N$81  (via drill 1.02)
  other vias: 48.26,35.56
N$82  (via drill 1.02)
  other vias: 48.26,38.1
N$83  (via drill 1.02)
  other vias: 45.72,33.02
N$84  (via drill 1.02)
  other vias: 45.72,35.56
N$85  (via drill 1.02)
  other vias: 45.72,38.1
N$86  (via drill 1.02)
  other vias: 43.18,33.02
N$87  (via drill 1.02)
  other vias: 43.18,35.56
N$88  (via drill 1.02)
  other vias: 43.18,38.1
N$89  (via drill 1.02)
  other vias: 55.88,33.02
N$90  (via drill 1.02)
  other vias: 55.88,35.56
N$91  (via drill 1.02)
  other vias: 55.88,38.1
N$92  (via drill 1.02)
  other vias: 53.34,33.02
N$93  (via drill 1.02)
  other vias: 53.34,35.56
N$94  (via drill 1.02)
  other vias: 53.34,38.1
N$95  (via drill 1.02)
  other vias: 50.8,33.02
N$96  (via drill 1.02)
  other vias: 50.8,35.56
N$97  (via drill 1.02)
  other vias: 50.8,38.1
N$98  (via drill 0.5)
  other vias: 6.35,13.97
N$99  (via drill 0.5)
  other vias: 5.08,13.97
N$100  (via drill 1.02)
  other vias: 63.5,38.1
N$101  (via drill 1.02)
  other vias: 60.96,33.02
N$102  (via drill 1.02)
  other vias: 60.96,35.56
N$103  (via drill 1.02)
  other vias: 60.96,38.1
N$104  (via drill 1.02)
  other vias: 58.42,33.02
N$105  (via drill 1.02)
  other vias: 58.42,35.56
N$106  (via drill 1.02)
  other vias: 58.42,38.1
N$107  (via drill 0.5)
  other vias: 3.81,13.97
N$108  (via drill 0.5)
  other vias: 2.54,13.97
N$109  (via drill 0.5)
  other vias: 3.81,21.59
N$110  (via drill 0.5)
  other vias: 2.54,21.59
N$111  (via drill 0.5)
  other vias: 1.27,21.59
N$112  (via drill 0.5)
  other vias: 1.27,13.97
N$113
  Top 0.254: C12.2 19.18,26.71 19.18,29.97 X2.2 19.14,30.7 R12.2 19.05,33.87 19.05,34.42 18.67,34.8 16.76,34.8 15.77,35.79 IC2.2
N$114
  Top 0.254: C13.2 13.84,26.71 13.84,29.97 X2.1 14.1,32.13 15.58,33.62 R13.2 R12.1
N$115  (via drill 0.5)
  Top 0.406: 7.07,39.79 P1.VBUS
  Top 0.61: v7.37,40.64 7.2,40.47 | v7.37,40.64 v8.38,40.64 | 1.65,29.97 F1.1 | 1.65,29.97 v1.65,30.61 | v1.65,29.34 1.65,29.97 | v7.37,40.64 7.07,40.35 7.07,39.79
  Bottom 0.61: v1.65,29.34 1.65,35.43 6.86,40.64 v7.37,40.64 v8.38,40.64
N$117
  Top 0.254: 10.88,44.62 C6.1 | 13.97,41.53 13.97,40.77 14.35,40.39 14.71,40.39 IC2.27
  Top 0.305: 13.97,41.53 10.88,44.62
RD+  (via drill 0.5)
  Top 0.254: IC2.29 13.36,39.37 v13.28,39.42 | R15.1 11.85,35.73 v12.57,36.45
  Bottom 0.254: v13.28,39.42 12.57,38.71 v12.57,36.45
RD-
  Top 0.254: R14.1 11.85,41.24 12.45,40.64 12.45,38.86 12.83,38.48 13.59,38.48 13.97,38.86 14.71,38.86 IC2.30
RESET  (via drill 0.5)
  Top 0.254: IC1.1 62.23,21.84 63.25,22.86 63.25,24.96 P2.5 | 55.88,28.57 S1.4 | 55.88,28.57 S1.3 | v55.88,28.7 55.88,28.57 | 50.29,29.3 R1.1 | C8.2 22.01,41.12 v22.1,41.2
  Top 0.305: 50.29,29.3 v50.29,27.94 50.29,29.97 49.78,30.48 48.01,30.48 46.74,29.21 46.74,23.62 | 46.74,23.62 46.74,22.86 45.72,21.84 45.72,18.03 45.21,17.53 42.67,17.53 42.42,17.27 30.48,17.27 29.72,16.51 29.72,15.75 30.23,15.24 34.29,15.24 35.56,13.97 35.56,10.16 33.02,7.62 J6.3 | 46.74,23.62 v47.24,23.62
  Bottom 0.305: v50.29,27.94 55.12,27.94 v55.88,28.7 58.93,28.7 62.28,25.35 P2.5 | v47.24,23.62 47.24,23.37 45.72,21.84 45.72,19.05 43.43,16.76 38.86,16.76 37.34,18.29 36.07,18.29 35.56,18.8 35.56,21.84 35.05,22.35 33.53,22.35 30.73,25.15 30.73,27.94 27.18,31.5 26.16,31.5 22.1,35.56 v22.1,41.2
RESET2  (via drill 0.5)
  Top 0.254: 14.73,43.18 15.27,42.64 IC2.24 | R11.1 10.25,32.6 v11.18,33.53
  Top 0.305: P3.5 12.45,45.97 12.45,43.94 13.21,43.18 14.73,43.18
  Bottom 0.254: v11.18,33.53 11.68,34.04 11.68,39.37 12.45,40.13
  Bottom 0.305: 12.45,40.13 12.45,45.97 P3.5
RXLED  (via drill 0.5)
  Top 0.254: IC2.10 19.34,38.35 19.81,38.35 20.45,37.72 v20.7,37.72
  Top 0.305: R2.1 22.01,27.47 v22.86,28.32
  Bottom 0.305: v20.7,37.72 21.34,37.08 21.34,35.31 24.64,32 24.64,31.24 23.37,29.97 23.37,28.83 v22.86,28.32
SCK2
  Top 0.254: IC2.15 19.34,40.89 20.07,40.89 20.19,41.02 20.19,41.4 20.83,42.04
  Top 0.305: 20.83,42.04 20.83,48.01 20.07,48.77 17.02,48.77 16.26,48.01 P3.3
TXLED  (via drill 0.5)
  Top 0.254: IC2.11 20.57,38.86 v20.7,38.99
  Top 0.305: R3.1 22.01,24.8 21.97,24.77 v21.97,23.88
  Bottom 0.305: v21.97,23.88 21.84,24 21.84,28.7 22.61,29.46 22.61,30.23 23.5,31.11 23.5,32.13 20.57,35.05 20.57,36.58 19.81,37.34 19.81,38.1 v20.7,38.99
USBRXD
  Top 0.254: IC2.9 20.49,36.7 21.21,36.7 21.97,37.47 21.97,38.35 22.01,38.39 R5.2
USBTXD
  Top 0.254: R4.2 20.7,35.81 20.32,36.2 20.07,36.2 19.56,36.7 18.92,36.7 18.77,36.86 IC2.8
USBVCC
  Top 0.254: IC2.31 14.24,38.37 13.46,37.59 13.46,36.07 11.94,34.54 10.16,34.54 8.89,33.27 8.89,29.97
  Top 0.61: Q1.3 9.4,29.46 8.89,29.97 F1.2
VIN  (via drill 0.5)
  Top 0.406: 17.69,11.18 17.78,11.26 C1.+
  Top 0.813: IC3.3 12.71,20.06 13.34,19.43 R8.2
  Top 1.422: 17.69,11.18 14.48,11.18 13.21,12.45 10.16,12.45 8.64,13.97 8.64,16.76 11.17,19.3 IC3.3 | v20.7,8.26 v21.46,7.62 | D1.C 22.35,3.98 22.35,6.6 v20.7,8.26 | v20.7,8.26 17.78,11.18 C1.+
  Bottom 1.422: J6.8 45.72,5.08 45.21,5.59 31.5,5.59 30.23,4.32 25.27,4.32 v21.46,7.62 v20.7,8.26
(copper drawn outside any net)
  shapes: Bottom area x1, Top area x1

### Text on the board
tPlace: Eleven | R3 | v2.0 | 1 | A | GND | 13 | 12 | 11 | 10 | 9 | 8 | 7 | 6 | 5 | 4 | 3 | 2 | 1 | 0 | REF | PWM | PWM | PWM | Digital | PWM | PWM | PWM | TX | RX | GROUND | UBOOT | ICSP-USB | -EN | RESET | ICSP | www.freetronics.com | 1 | freetronics | Reset | PWR | RX | USB | TX | 7-12V | D13 | DC | 2.1mm | IO | Power | Analog | REF | RST | 3V3 | 5V | GND | GND | VIN | 0 | 1 | 2 | 3 | 4 | 5
bPlace: Eleven | v1.0 | A | GND | 13 | 12 | 11 | 10 | 9 | 8 | 7 | 6 | 5 | 4 | 3 | 2 | 1 | 0 | REF | PWM | PWM | PWM | Digital | PWM | PWM | PWM | TX | RX | +5V | GND | freetronics | CC | ROHS | www.freetronics.com/eleven | SKU: ELEVEN | IO | Power | Analog | REF | RST | 3V3 | 5V | GND | GND | VIN | 0 | 1 | 2 | 3 | 4 | 5